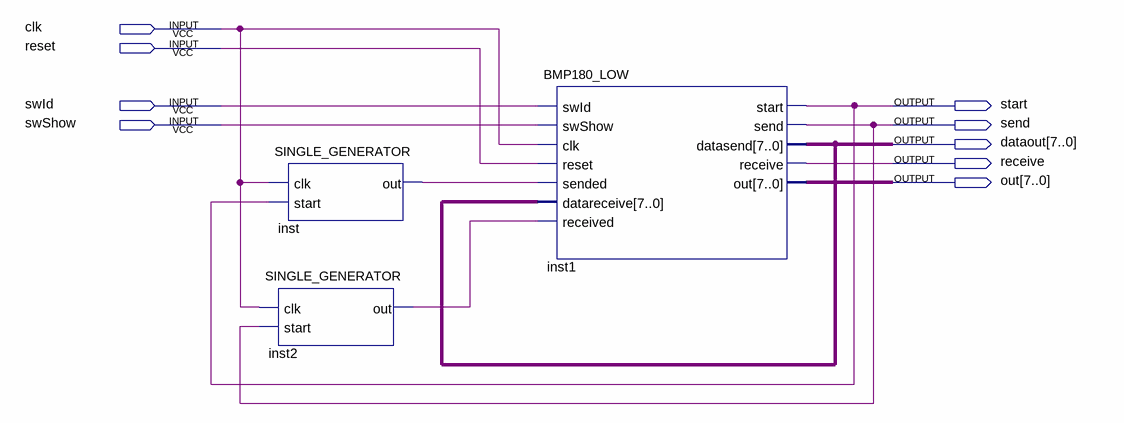
[diagram p0: schematic sheet]
// Quartus schematic BMP180_LOW_SHM.bdf as structural Verilog: 3 symbols, 9 pins
module BMP180_LOW_SHM (
  input  clk,
  input  reset,
  input  swId,
  input  swShow,
  output start,
  output send,
  output [7:0] dataout,
  output receive,
  output [7:0] out
);

  wire inst2_out, inst_out;

  SINGLE_GENERATOR inst (.clk(clk), .start(start), .out(inst_out));
  SINGLE_GENERATOR inst2 (.clk(clk), .start(send), .out(inst2_out));
  BMP180_LOW inst1 (
    .swId(swId), .swShow(swShow), .clk(clk), .reset(reset), .sended(inst_out), .datareceive(dataout),
    .received(inst2_out), .start(start), .send(send), .datasend(dataout), .receive(receive), .out(out));
endmodule
